# Altium schematic sheet 18.ADB.SchDoc
size A4; CheckedBy: YPC; DocumentNumber: 18; Revision: V1.00; SheetNumber: 18; SheetTotal: 18; SheetName: ADB; SheetDescribe: SheetDescribe; Designer: JOW; DesignDate: 2025-04-25; CheckedData: 2025-04-25; Rule: PcbType=ProtelPcb
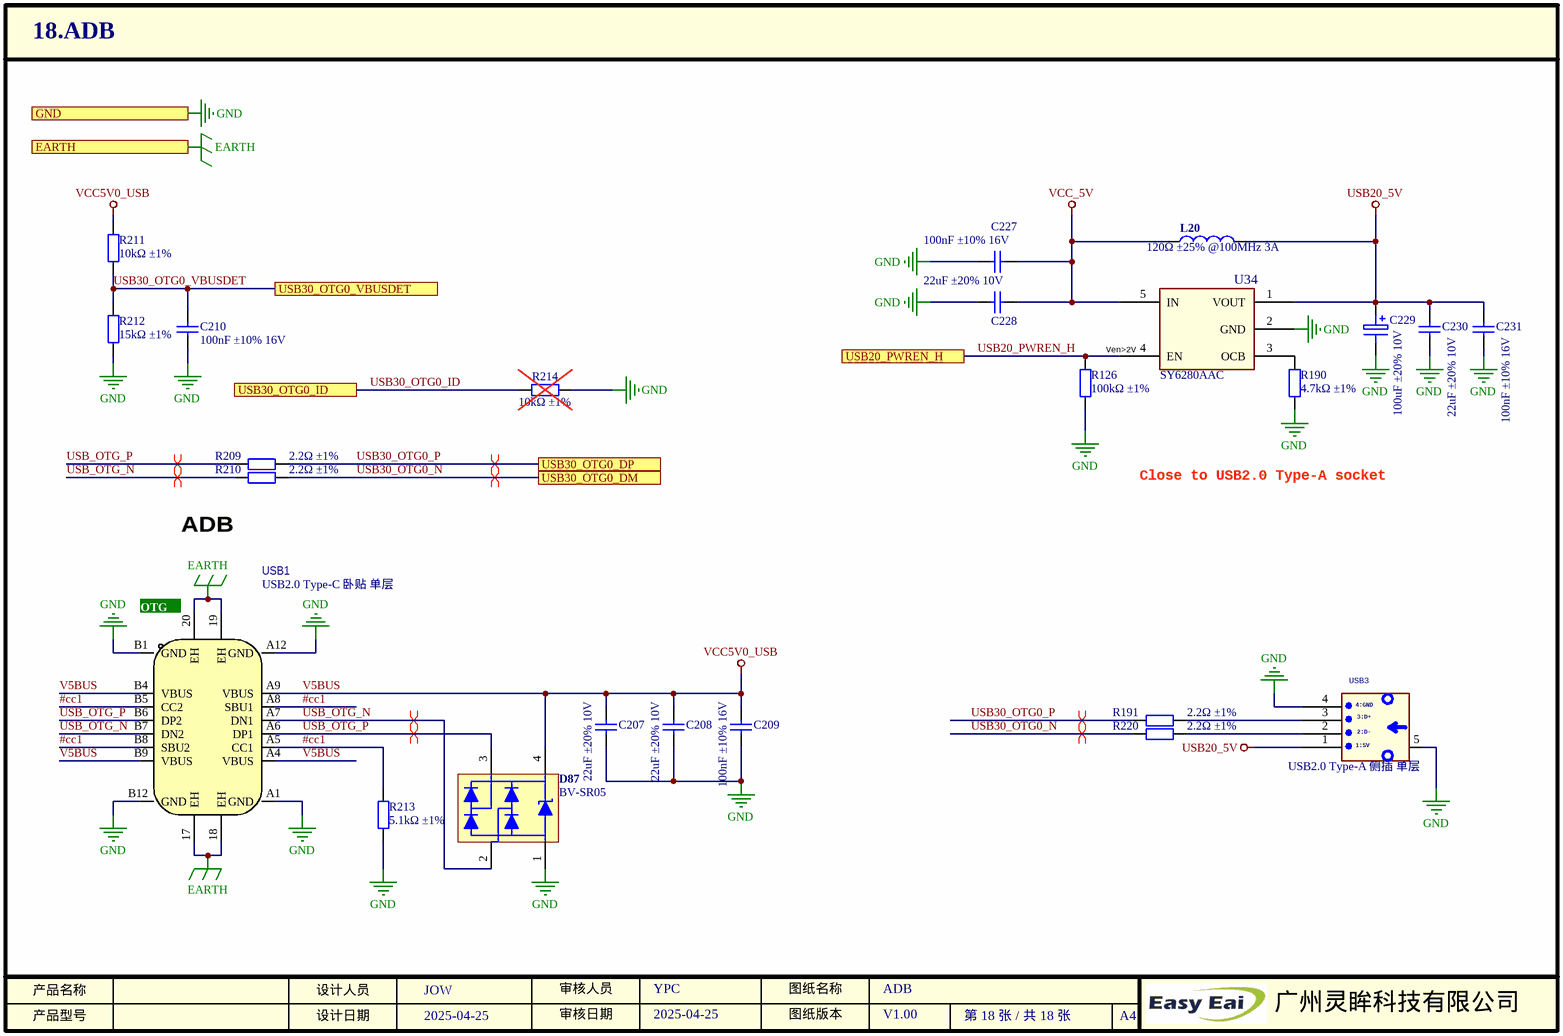
[diagram p0: 18.ADB.SchDoc]

## Parts
C207  描述: 22uF ±20% 10V  [0603_C]  (hidden comment: CL10A226MP8NUNE)
C208  描述: 22uF ±20% 10V  [0603_C]  (hidden comment: CL10A226MP8NUNE)
C209  描述: 100nF ±10% 16V  [0402_C]  (hidden comment: CL05B104KO5NNNC)
C210  描述: 100nF ±10% 16V  [0402_C]  (hidden comment: CL05B104KO5NNNC)
C227  描述: 100nF ±10% 16V  [0402_C]  (hidden comment: CL05B104KO5NNNC)
C228  描述: 22uF ±20% 10V  [0603_C]  (hidden comment: CL10A226MP8NUNE)
C229  描述: 100uF ±20% 10V  [SMD,D5xL5.4mm]  (hidden comment: RVT1A101M0505)
C230  描述: 22uF ±20% 10V  [0603_C]  (hidden comment: CL10A226MP8NUNE)
C231  描述: 100nF ±10% 16V  [0402_C]  (hidden comment: CL05B104KO5NNNC)
D87  BV-SR05  [SOT-143]
L20  BLM18KG121TN1D  [0603_R]  (value not drawn)  (no BOM)
R126  描述: 100kΩ ±1%  [0402_R]  (hidden comment: 0402WGF1003TCE)
R190  描述: 4.7kΩ ±1%  [0402_R]  (hidden comment: 0402WGF4701TCE)
R191  描述: 2.2Ω ±1%  [0402_R]  (hidden comment: 0402WGF220KTCE)
R209  描述: 2.2Ω ±1%  [0402_R]  (hidden comment: 0402WGF220KTCE)
R210  描述: 2.2Ω ±1%  [0402_R]  (hidden comment: 0402WGF220KTCE)
R211  描述: 10kΩ ±1%  [0402_R]  (hidden comment: 0402WGF1002TCE)
R212  描述: 15kΩ ±1%  [0402_R]  (hidden comment: 0402WGF1502TCE)
R213  描述: 5.1kΩ ±1%  [0402_R]  (hidden comment: 0402WGF5101TCE)
R214  描述: 10kΩ ±1%  [0402_R]  (hidden comment: NC/0402WGF1002TCE)  (no BOM)
R220  描述: 2.2Ω ±1%  [0402_R]  (hidden comment: 0402WGF220KTCE)
U34  SY6280AAC  [SOT-23-5]
USB1  USB2.0 Type-C 卧贴 单层  [USB-TYPE-C_16PIN-MALE-TYPE-C-31-M-12]
USB3  U221-041N-1BU07-S1  [MINI-USB-SMD_U221-041N-1BU07-S1]  (value not drawn)

## Ports
EARTH, GND, USB20_PWREN_H, USB30_OTG0_DM, USB30_OTG0_DP, USB30_OTG0_ID, USB30_OTG0_VBUSDET

## Nets
EARTH: USB1.17(EH) USB1.18(EH) USB1.19(EH) USB1.20(EH) ; port EARTH
GND: C207.1 C208.1 C209.1 C210.1 C227.1 C228.2 C229.2 C230.1 C231.1 D87.1 R126.1 R190.1 R212.1 R213.1 R214.1 U34.2(GND) USB1.A1(GND) USB1.A12(GND) USB1.B1(GND) USB1.B12(GND) USB3.4 USB3.5 ; port GND
USB20_5V: C229.1 C230.2 C231.2 L20.2 U34.1(VOUT) USB3.1
V5BUS: C207.2 C208.2 C209.2 D87.4 R211.2 USB1.A4(VBUS) USB1.A9(VBUS) USB1.B4(VBUS) USB1.B9(VBUS)  [also labelled VCC5V0_USB]
VCC_5V: C227.2 C228.1 L20.1 U34.5(IN)
#cc1: R213.2 USB1.A5(CC1) USB1.A8(SBU1) USB1.B5(CC2) USB1.B8(SBU2)
USB20_PWREN_H: R126.2 U34.4(EN) ; port USB20_PWREN_H
USB30_OTG0_ID: R214.2 ; port USB30_OTG0_ID
USB30_OTG0_N: R210.2 R220.1 ; port USB30_OTG0_DM
USB30_OTG0_P: R191.1 R209.2 ; port USB30_OTG0_DP
USB30_OTG0_VBUSDET: C210.2 R211.1 R212.2 ; port USB30_OTG0_VBUSDET
USB_OTG_N: D87.2 R210.1 USB1.A7(DN1) USB1.B7(DN2)
USB_OTG_P: D87.3 R209.1 USB1.A6(DP1) USB1.B6(DP2)
NetR190_2: R190.2 U34.3(OCB)
NetR191_2: R191.2 USB3.3
NetR220_2: R220.2 USB3.2

## Layout directives
differential pair: USB30_OTG0_N, USB30_OTG0_P, USB_OTG_N, USB_OTG_P

## Notes on the sheet
- Ven>2V
- Close to USB2.0 Type-A socket
- ADB
- (near USB1) OTG
- 产品名称
- 产品型号
- 设计人员
- 设计日期
- 审核人员
- 审核日期
- 图纸版本
- 图纸名称
- A4
- 广州灵眸科技有限公司
- (in symbol USB2.0 Type-A 侧插 单层) 4:GND; 3:D+; 2:D-; 1:5V

## Library data of the parts
C207 C208 C228 C230 = 0603 22uF ±20% 10V: SPZL000315; 名称: 贴片电容; 厂商: SAMSUNG(三星); 封装: 0603; 工作温度: -55~85℃; 贴片和直插: SMD; 型号: CL10A226MP8NUNE; SuppliersPartNumber: C86295; 商品编号: SPZL000315
C209 C210 C227 C231 = 0402 100nF ±10% 16V: SPZL000259; 名称: 贴片电容; 厂商: SAMSUNG(三星); 封装: 0402; 工作温度: -55~125℃; 贴片和直插: SMD; 型号: CL05B104KO5NNNC; SuppliersPartNumber: C1525; 商品编号: SPZL000259
C229 = 电解电容 100uF ±20% 10V: SPZL000265; 名称: 电解电容; 厂商: ROQANG(容强); 贴片和直插: SMD; 工作温度: -55~105℃; SuppliersPartNumber: C72473; 封装: SMD,D5xL5.4mm; 型号: RVT1A101M0505; 商品编号: SPZL000265
D87 = TVS BV-SR05: SPZL000616; 名称: TVS; 厂商: Bencent(槟城); 贴片和直插: SMD; 描述: Vdrm=5V Cj=0.85pF; 工作温度: -40~125℃; 封装: SOT-143; SuppliersPartNumber: C413946; 商品编号: SPZL000616; 型号: BV-SR05
L20 = 120Ω ±25% @100MHz 3A: SPZL000842; 名称: 磁珠; 封装: 0603; 厂商: muRata(村田); 贴片和直插: SMD; 工作温度: -40~85℃; SuppliersPartNumber: C85831; 型号: BLM18KG121TN1D; 商品编号: SPZL000842; 描述: 120Ω ±25% @100MHz 3A
R126 = 0402 100kΩ ±1%: SPZL000282; 封装: 0402; 厂商: UNI-ROYAL(厚声); 贴片和直插: SMD; 名称: 电阻; 工作温度: -55~155℃; SuppliersPartNumber: C25741; 型号: 0402WGF1003TCE; 商品编号: SPZL000282
R190 = 0402 4.7kΩ ±1%: SPZL000280; 封装: 0402; 厂商: UNI-ROYAL(厚声); 贴片和直插: SMD; 名称: 电阻; 工作温度: -55~155℃; SuppliersPartNumber: C25900; 型号: 0402WGF4701TCE; 商品编号: SPZL000280
R191 R209 R210 R220 = 0402 2.2Ω ±1%: SPZL000327; 封装: 0402; 厂商: UNI-ROYAL(厚声); 贴片和直插: SMD; 名称: 电阻; 工作温度: -55~155℃; SuppliersPartNumber: C25101; 型号: 0402WGF220KTCE; 商品编号: SPZL000327
R211 R214 = 0402 10kΩ ±1%: SPZL000271; 封装: 0402; 厂商: UNI-ROYAL(厚声); 贴片和直插: SMD; 名称: 电阻; 工作温度: -55~155℃; SuppliersPartNumber: C25744; 型号: 0402WGF1002TCE; 商品编号: SPZL000271
R212 = 0402 15kΩ ±1%: SPZL000330; 封装: 0402; 厂商: UNI-ROYAL(厚声); 贴片和直插: SMD; 名称: 电阻; 工作温度: -55~155℃; SuppliersPartNumber: C25756; 型号: 0402WGF1502TCE; 商品编号: SPZL000330
R213 = 0402 5.1kΩ ±1%: SPZL000270; 封装: 0402; 厂商: UNI-ROYAL(厚声); 贴片和直插: SMD; 名称: 电阻; 工作温度: -55~155℃; SuppliersPartNumber: C25905; 型号: 0402WGF5101TCE; 商品编号: SPZL000270
U34 = SY6280AAC: SPZL000043; 贴片和直插: SMD; 厂商: silergy(矽力杰); 名称: 电源IC; 描述: 功率电子开关; 工作温度: -40~85℃; SuppliersPartNumber: C55136; 封装: SOT-23-5; 商品编号: SPZL000043; 型号: SY6280AAC
USB1 = USB2.0 Type-C 卧贴 单层: SPZL000132; 厂商: 韩国韩荣; 名称: USB连接器; 封装: SMD; 型号: TYPE-C-31-M-12; 贴片和直插: SMD; 商品编号: SPZL000132; SuppliersPartNumber: C165948; 描述: USB2.0 Type-C 卧贴 单层
USB3 = USB2.0 Type-A 侧插 单层: SPZL001070; 厂商: XKB Connection(中国星坤); 封装: 插件; 名称: USB连接器; 贴片和直插: THT; 工作温度: -45~85℃; 型号: U221-041N-1BU07-S1; 商品编号: SPZL001070; SuppliersPartNumber: C2682184; 描述: USB2.0 Type-A 侧插 单层